# EAGLE schematic nixie_clock (EAGLE 8.4.1)
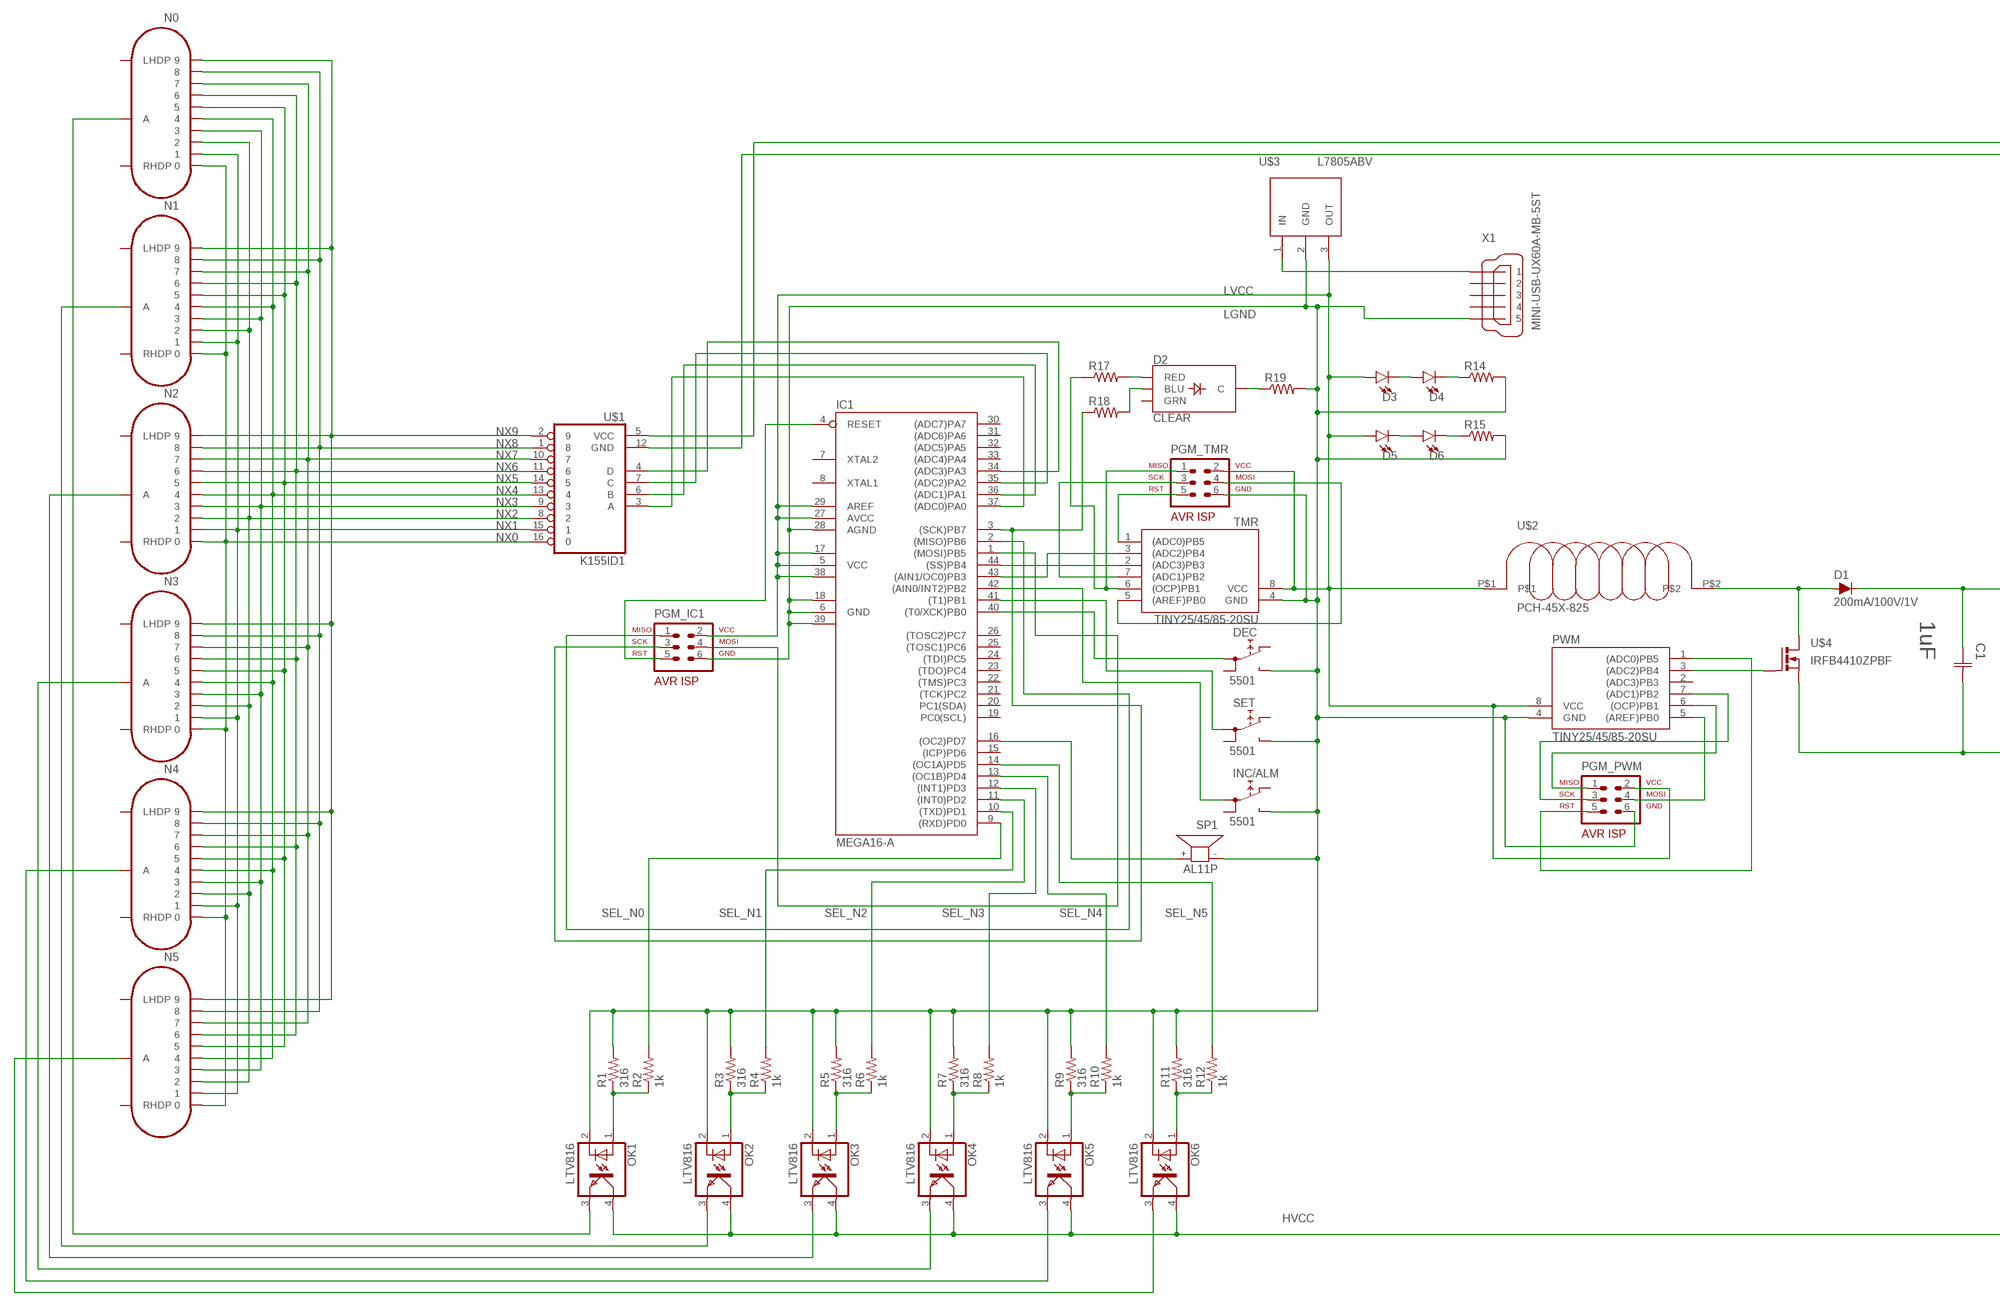
[diagram p0: schematic, sheet 1, part 1 of 2]
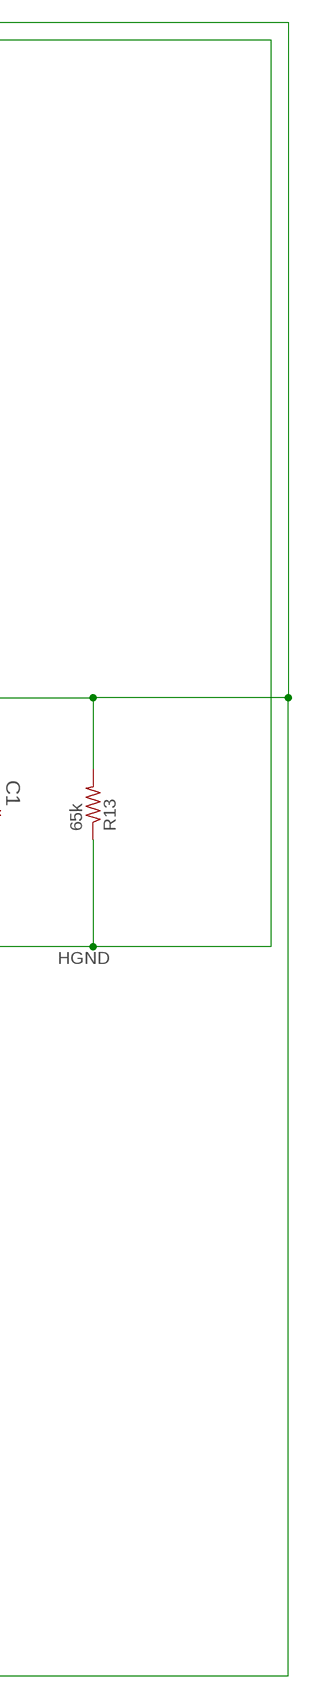
[diagram p1: schematic, sheet 1, part 2 of 2]

## Parts
C1  1uF  C1210C105K5RACTU  [CAPC3225X170N]
D1  200mA/100V/1V  DIODE-1N4148  [DIODE-1N4148]
D2  CLEAR  LED-RGB-CCCLEAR  [LED-RGB-THRU]
D3  LED5MM  [LED_5MM]
D4  LED5MM  [LED_5MM]
D5  LED5MM  [LED_5MM]
D6  LED5MM  [LED_5MM]
DEC  5501  [5501]
IC1  MEGA16-A  [TQFP44]
INC/ALM  5501  [5501]
N0  IN-14  [IN-14]
N1  IN-14  [IN-14]
N2  IN-14  [IN-14]
N3  IN-14  [IN-14]
N4  IN-14  [IN-14]
N5  IN-14  [IN-14]
OK1  LTV816  [DIL04]
OK2  LTV816  [DIL04]
OK3  LTV816  [DIL04]
OK4  LTV816  [DIL04]
OK5  LTV816  [DIL04]
OK6  LTV816  [DIL04]
PGM_IC1  AVR-ISP-6HORZ  [AVR-ISP-6R]
PGM_PWM  AVR-ISP-6HORZ  [AVR-ISP-6R]
PGM_TMR  AVR-ISP-6HORZ  [AVR-ISP-6R]
PWM  TINY25/45/85-20SU  [SOIC8]
R1  316  R-US_M1206  [M1206]
R2  1k  R-US_M1206  [M1206]
R3  316  R-US_M1206  [M1206]
R4  1k  R-US_M1206  [M1206]
R5  316  R-US_M1206  [M1206]
R6  1k  R-US_M1206  [M1206]
R7  316  R-US_M1206  [M1206]
R8  1k  R-US_M1206  [M1206]
R9  316  R-US_M1206  [M1206]
R10  1k  R-US_M1206  [M1206]
R11  316  R-US_M1206  [M1206]
R12  1k  R-US_M1206  [M1206]
R13  65k  R-US_M1206  [M1206]
R14  R-US_0204/7  [0204/7]
R15  R-US_0204/7  [0204/7]
R17  R-US_0204/7  [0204/7]
R18  R-US_0204/7  [0204/7]
R19  R-US_0204/7  [0204/7]
SET  5501  [5501]
SP1  AL11P  [AL11P]
TMR  TINY25/45/85-20SU  [SOIC8]
U$1  K155ID1  [DIL16]
U$2  PCH-45X-825  [PCH-45X-825]
U$3  L7805ABV  [TO220AB]
U$4  IRFB4410ZPBF  [TO220AB]
X1  MINI-USB-UX60A-MB-5ST  [UX60A-MB-5ST]

## Nets
HGND: C1.2(C2) R13.1 U$1.12(GND) U$4.3(SG1)
HVCC: C1.1(C1) D1.C OK1.4(COL) OK2.4(COL) OK3.4(COL) OK4.4(COL) OK5.4(COL) OK6.4(COL) R13.2 U$1.5(VCC)
LGND: DEC.NO IC1.6(GND) IC1.18(GND1) IC1.28(AGND) IC1.39(GND2) INC/ALM.NO OK1.2(C) OK2.2(C) OK3.2(C) OK4.2(C) OK5.2(C) OK6.2(C) PGM_IC1.6 PGM_PWM.6 PGM_TMR.6 PWM.4(GND) R1.2 R3.2 R5.2 R7.2 R9.2 R11.2 R14.2 R15.2 R19.2 SET.NO SP1.- TMR.4(GND) U$3.2(GND) X1.5
LVCC: D3.A D5.A IC1.5(VCC) IC1.17(VCC1) IC1.27(AVCC) IC1.29(AREF) IC1.38(VCC2) PGM_IC1.2 PGM_PWM.2 PGM_TMR.2 PWM.8(VCC) TMR.8(VCC) U$2.P$1 U$3.3(OUT)
N$1: IC1.37((ADC0)PA0) U$1.3(A)
N$2: IC1.36((ADC1)PA1) U$1.6(B)
N$3: IC1.35((ADC2)PA2) U$1.7(C)
N$4: IC1.34((ADC3)PA3) U$1.4(D)
N$5: PGM_TMR.3 TMR.7((ADC1)PB2)
N$6: IC1.43((AIN1/OC0)PB3) TMR.3((ADC2)PB4)
N$7: DEC.1A IC1.40((T0/XCK)PB0)
N$8: IC1.41((T1)PB1) SET.1A
N$9: IC1.42((AIN0/INT2)PB2) INC/ALM.1A
N$10: OK1.1(A) R1.1 R2.1
N$11: OK2.1(A) R3.1 R4.1
N$12: OK3.1(A) R5.1 R6.1
N$13: OK4.1(A) R7.1 R8.1
N$14: OK5.1(A) R9.1 R10.1
N$15: OK6.1(A) R11.1 R12.1
N$16: N0.A OK1.3(EMIT)
N$17: N1.A OK2.3(EMIT)
N$18: N2.A OK3.3(EMIT)
N$19: N3.A OK4.3(EMIT)
N$20: N4.A OK5.3(EMIT)
N$21: N5.A OK6.3(EMIT)
N$22: D1.A U$2.P$2 U$4.2(D)
N$23: PWM.3((ADC2)PB4) U$4.1(G)
N$24: IC1.16((OC2)PD7) SP1.+
N$25: D2.2(C) R19.1
N$26: D2.1(RED) R17.2
N$27: D2.4(BLU) R18.2
N$28: PGM_TMR.1 R17.1 TMR.6((OCP)PB1)
N$29: IC1.3((SCK)PB7) PGM_IC1.3 R18.1
N$30: PGM_TMR.4 TMR.5((AREF)PB0)
N$31: IC1.44((SS)PB4) TMR.2((ADC3)PB3)
N$32: PGM_PWM.1 PWM.6((OCP)PB1)
N$33: PGM_TMR.5 TMR.1((ADC0)PB5)
N$34: PGM_PWM.3 PWM.7((ADC1)PB2)
N$35: PGM_PWM.5 PWM.1((ADC0)PB5)
N$36: PGM_PWM.4 PWM.5((AREF)PB0)
N$37: IC1.1((MOSI)PB5) PGM_IC1.4
N$38: IC1.2((MISO)PB6) PGM_IC1.1
N$39: U$3.1(IN) X1.1
N$40: IC1.4(RESET) PGM_IC1.5
N$41: D3.K(C) D4.A
N$42: D4.K(C) R14.1
N$43: D5.K(C) D6.A
N$44: D6.K(C) R15.1
NX0: N0.0 N1.0 N2.0 N3.0 N4.0 N5.0 U$1.16
NX1: N0.1 N1.1 N2.1 N3.1 N4.1 N5.1 U$1.15
NX2: N0.2 N1.2 N2.2 N3.2 N4.2 N5.2 U$1.8
NX3: N0.3 N1.3 N2.3 N3.3 N4.3 N5.3 U$1.9
NX4: N0.4 N1.4 N2.4 N3.4 N4.4 N5.4 U$1.13
NX5: N0.5 N1.5 N2.5 N3.5 N4.5 N5.5 U$1.14
NX6: N0.6 N1.6 N2.6 N3.6 N4.6 N5.6 U$1.11
NX7: N0.7 N1.7 N2.7 N3.7 N4.7 N5.7 U$1.10
NX8: N0.8 N1.8 N2.8 N3.8 N4.8 N5.8 U$1.1
NX9: N0.9 N1.9 N2.9 N3.9 N4.9 N5.9 U$1.2
SEL_N0: IC1.9((RXD)PD0) R2.2
SEL_N1: IC1.10((TXD)PD1) R4.2
SEL_N2: IC1.11((INT0)PD2) R6.2
SEL_N3: IC1.12((INT1)PD3) R8.2
SEL_N4: IC1.13((OC1B)PD4) R10.2
SEL_N5: IC1.14((OC1A)PD5) R12.2
Unconnected: D2.3(GRN) DEC.1B DEC.NC IC1.7(XTAL2) IC1.8(XTAL1) IC1.15((ICP)PD6) IC1.19(PC0(SCL)) IC1.20(PC1(SDA)) IC1.21((TCK)PC2) IC1.22((TMS)PC3) IC1.23((TDO)PC4) IC1.24((TDI)PC5) IC1.25((TOSC1)PC6) IC1.26((TOSC2)PC7) IC1.30((ADC7)PA7) IC1.31((ADC6)PA6) IC1.32((ADC5)PA5) IC1.33((ADC4)PA4) INC/ALM.1B INC/ALM.NC N0.LHDP N0.RHDP N1.LHDP N1.RHDP N2.LHDP N2.RHDP N3.LHDP N3.RHDP N4.LHDP N4.RHDP N5.LHDP N5.RHDP PWM.2((ADC3)PB3) SET.1B SET.NC X1.2 X1.3 X1.4

## Library data of the parts
C1 = Kemet_By_element14_Batch_1:C1210C105K5RACTU: CAPACITOR, 1210; MPN: C1210C105K5RACTU; OC_FARNELL: 9227962; OC_NEWARK: 70K9187; SUPPLIER: Kemet; TOLERANCE: ±10%; VOLTAGERATING: 50V
D1 = Discrete-Semi:DIODE: Diode These are standard reverse protection diodes and small signal diodes. SparkFun Products: SparkFun SparkPunk Sound Kit <https://www.sparkfun.com/products/11177> SparkFun ESP8266 Thing <https://www.sparkfun.com/products/13231>; PROD_ID: DIO-08378
D2 = SparkFun-LED:LED-RGB-CC: LED-RGB Common Cathode Packages: LED RGB-THRU LED_PIRANHA_5MM SparkFun Products: RGB Diffused Common Cathode- Diffuse <[https://www.sparkfun.com/products/9264]> RGB Diffused Common Cathode - Clear <[https://www.sparkfun.com/products/105]> LED-RGB 5mm Square (Piranha) <[https://www.sparkfun.com/products/11679]>; PROD_ID: DIO-08418
D3-D6 = SparkFun-LED:LED: LED (Generic) Standard schematic elements and footprints for 5mm, 3mm, 1206, and 0603 sized LEDs. Generic LEDs with no color specified.
DEC INC/ALM SET = switch:55?: PUSHBUTTON SERIES 5500 SWITCHES Source: www.e-switch.com .. 5500.pdf
IC1 = avr-7:MEGA16: MICROCONTROLLER 16 Kbytes FLASH 1 kbytes SRAM 512 bytes EEPROM USART 8-channel 10 bit ADC
N0 N1-N5 = russian-nixies:IN-14: IN-14: medium numeric frontview nixie tube
OK1-OK6 = optocoupler:LTV816: OPTO COUPLER Source: LITEON, LTV816.pdf; OC_FARNELL: unknown; OC_NEWARK: unknown
PGM_IC1 PGM_PWM PGM_TMR = avr-7:AVR-ISP-6: AVR ISP-6 Serial Programming Header
PWM TMR = avr-7:TINY25/45/85
R1-R15 R17-R19 = resistor:R-US_: RESISTOR, American symbol
SP1 = buzzer:AL11P: SPEAKER Source: Buerklin; OC_FARNELL: unknown; OC_NEWARK: unknown
U$1 = K155ID1:K155ID1
U$2 = coilcraft-custom-inductors:PCH-45X-825
U$3 = ON-Semiconductor-custom:L7805ABV
U$4 = INFINEON_CUSTOM:IRFB4410ZPBF; SPICEPREFIX: U
X1 = con-hirose:MINI-USB-: MINI USB Connector Source: http://www.hirose.co.jp/cataloge_hp/e24000019.pdf; OC_FARNELL: unknown; OC_NEWARK: unknown